# Altium schematic sheet LedDriver.SchDoc: LED Driver Section
size A4; Author: Robocup; Organization: Robocup-AG; Address1: Vogt-Kölln-Str. 30; Address2: 225257 Hamburg; Address3: Germany; Address4: www.bit-bots.de; Revision: A
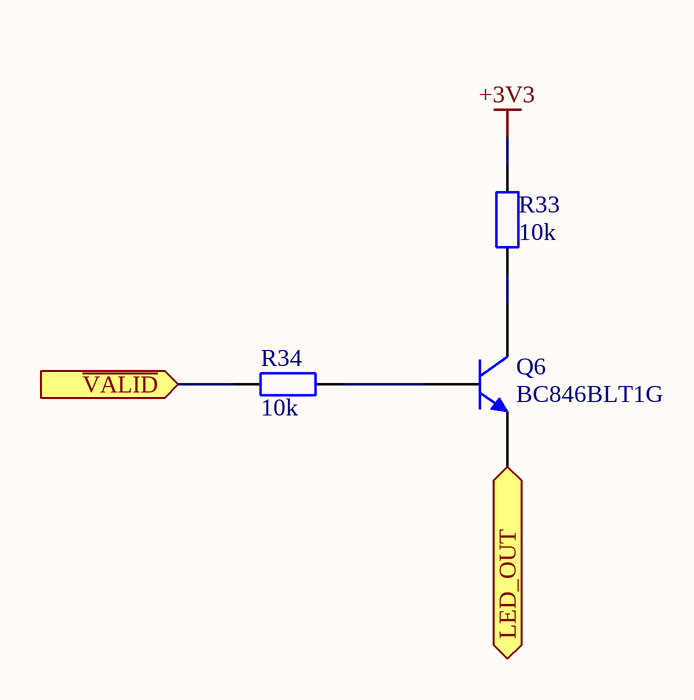
[diagram p0: LedDriver.SchDoc]

## Parts
Q6  BC846BLT1G  [SOT-23-TT3_N]
R33  10k  [R2012]
R34  10k  [R2012]

## Ports
LED_OUT (out), ~{VALID} (in)

## Nets
+3V3: R33.2
~{VALID}: R34.2 ; port ~{VALID}
LED_OUT: Q6.2(E) ; port LED_OUT
NetQ6_1: Q6.1(B) R34.1
NetQ6_3: Q6.3(C) R33.1

## Notes on the sheet
- Project:
- Author:
- Title:
- Date:
- Time:
- Rev:
- Sheet
- of
- File:

## Library data of the parts
Q6 = NPN: NPN Bipolar Transistor; Published: 8-Jun-2000; LatestRevisionDate: 17-Jul-2002; LatestRevisionNote: Re-released for DXP Platform.; PackageReference: TO-226-AA; Publisher: Altium Limited; PackageDescription: TO, Flat Index; 3 In-Line, Axial Leads; Body Dia. 4.8mm; Leads 0.55 x 0.51 mm (max); Code_JEDEC: TO-226-AA
R33 R34 = Res2: Resistor; Published: 8-Jun-2000; LatestRevisionDate: 17-Jul-2002; LatestRevisionNote: Re-released for DXP Platform.; PackageReference: AXIAL-0.4; Publisher: Altium Limited; PackageDescription: Axial Device, Thru-Hole; 2 Leads; 0.4 in Pin Spacing; Value: 10k